# Altium schematic sheet 03-4G.SchDoc
size A3
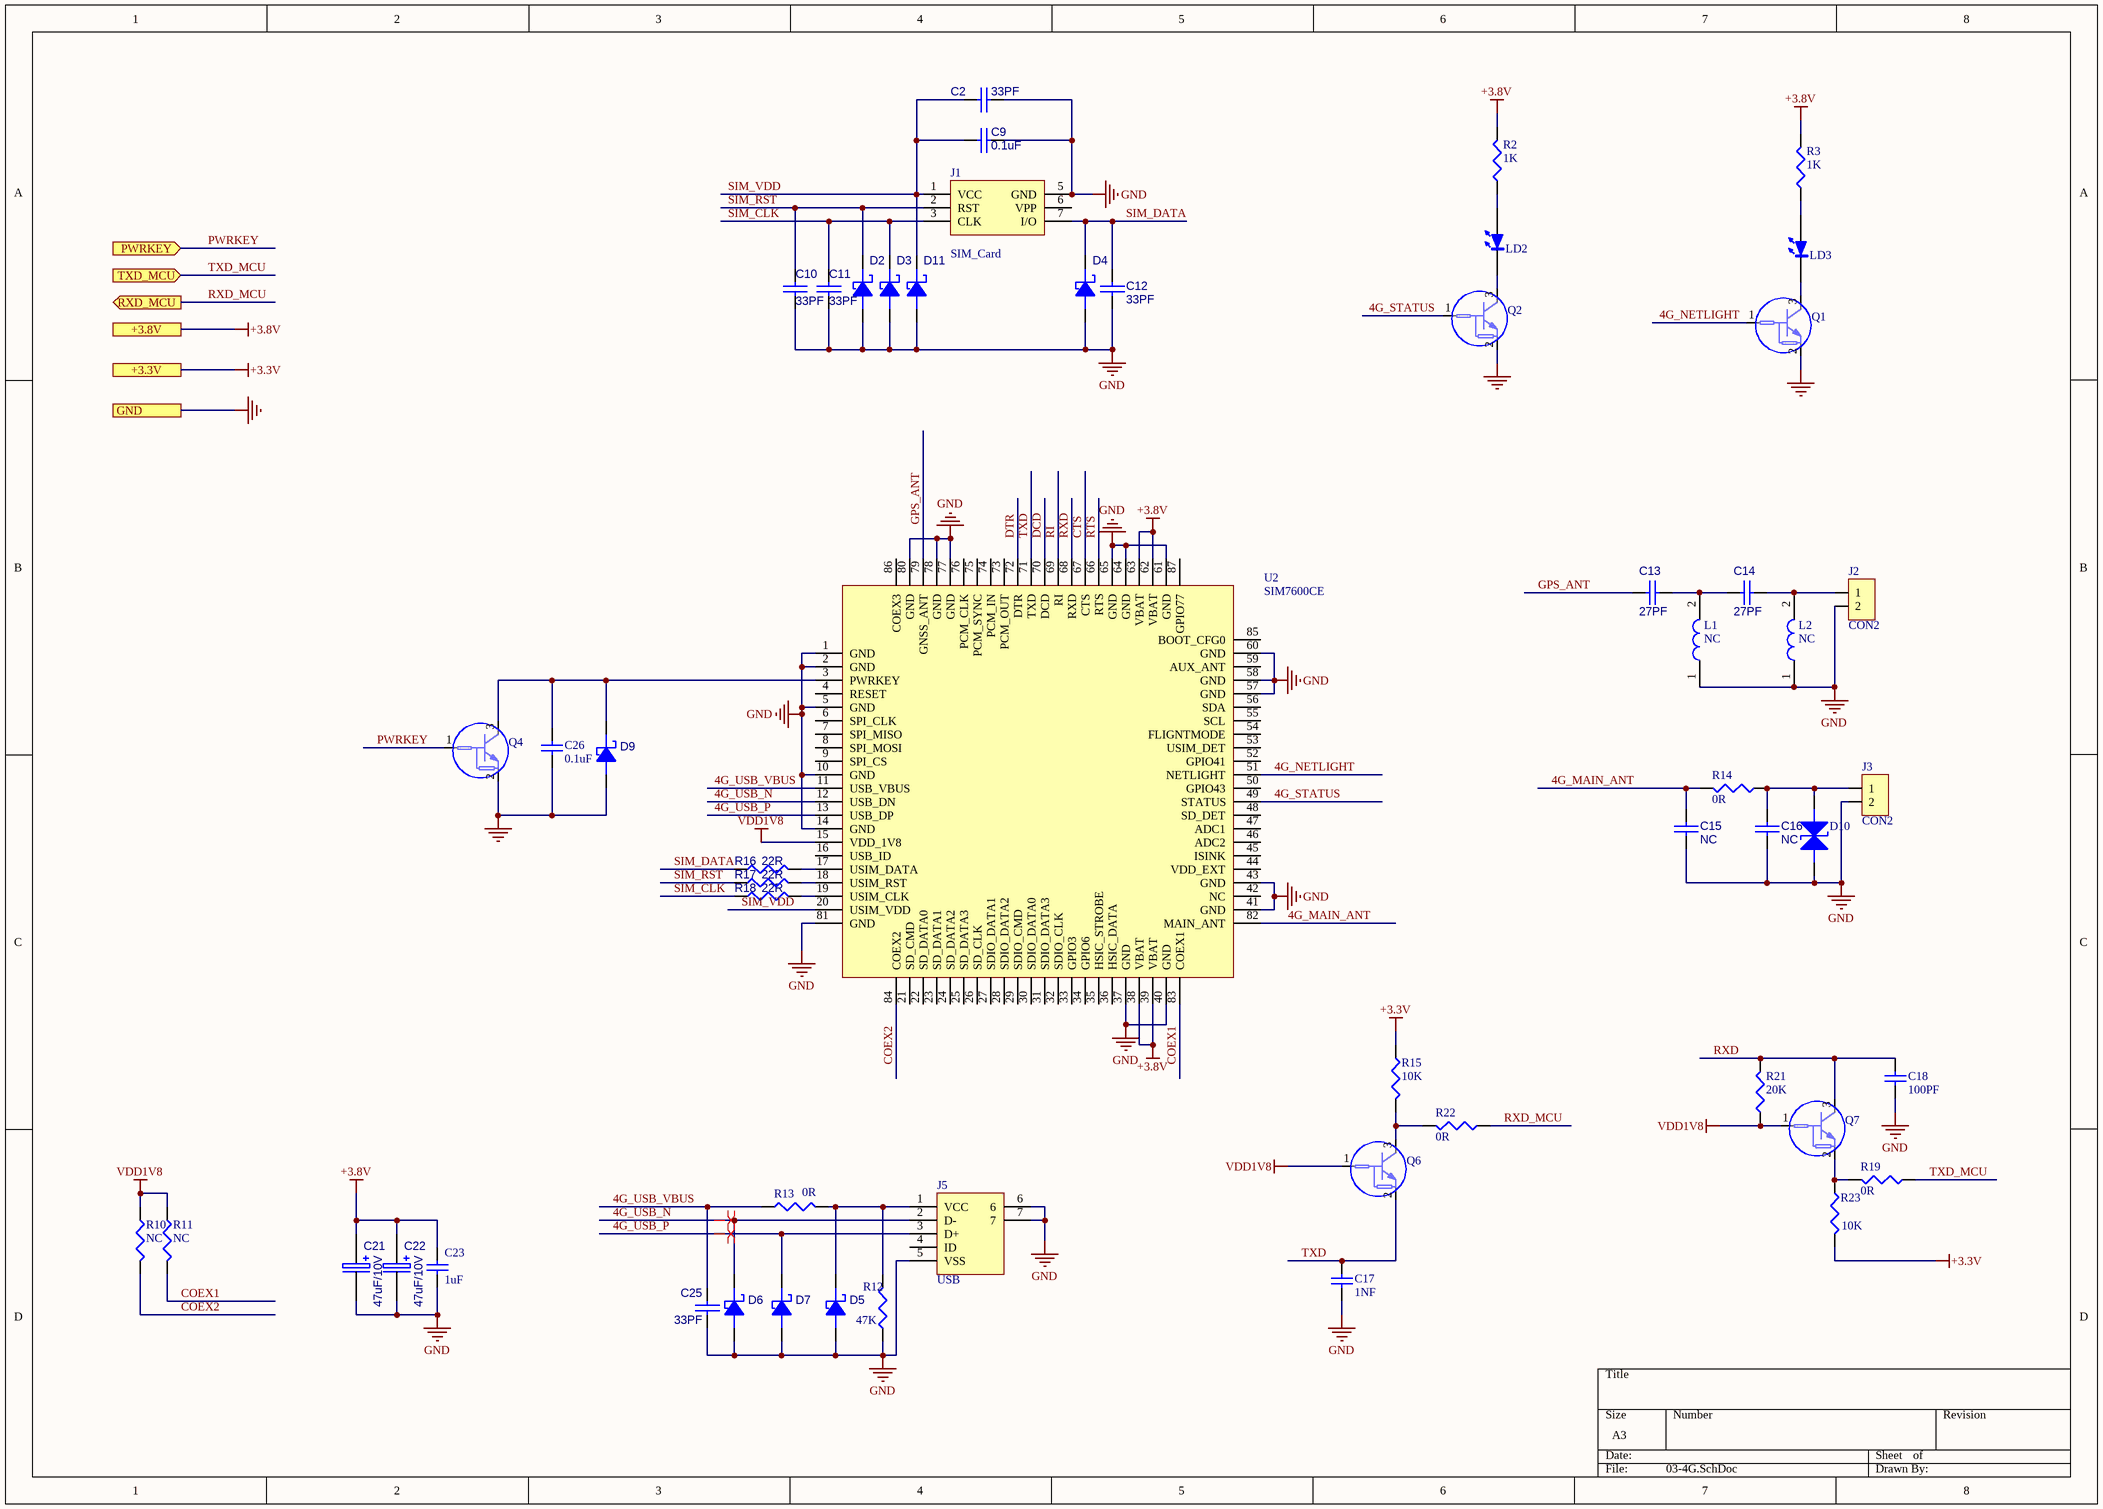
[diagram p0: 03-4G.SchDoc]

## Parts
C2  33PF  [0603_C]
C9  0.1uF  [0603_C]
C10  33PF  [0603_C]
C11  33PF  [0603_C]
C12  33PF  [0603_C]
C13  27PF  [0402]
C14  27PF  [0402]
C15  NC  [0402]
C16  NC  [0402]
C17  1NF  [0603_C]
C18  100PF  [0603_C]
C21  47uF/10V  [C_TAN_B]
C22  47uF/10V  [C_TAN_B]
C23  1uF  [0603_C]
C25  33PF  [0603_C]
C26  0.1uF  [0603_C]
D2  ESD9M5.0ST5G  [SOD-923]  (value not drawn)
D3  ESD9M5.0ST5G  [SOD-923]  (value not drawn)
D4  ESD9M5.0ST5G  [SOD-923]  (value not drawn)
D5  PESD12VS1UB  [SOD523]  (value not drawn)
D6  ESD9L5.0ST5G  [SOD-923]  (value not drawn)
D7  ESD9L5.0ST5G  [SOD-923]  (value not drawn)
D9  ESD9M5.0ST5G  [SOD-923]  (value not drawn)
D10  LXES15AAA1-153  [0402]  (value not drawn)
D11  ESD9M5.0ST5G  [SOD-923]  (value not drawn)
J1  SIM_Card  [MicroSIM-6]
J2  CON2  [RF-Z]
J3  CON2  [RF-Z]
J5  USB
L1  NC  [0402]
L2  NC  [0402]
LD2  WHITE  [LED_0603]  (value not drawn)
LD3  WHITE  [LED_0603]  (value not drawn)
Q1  DTC143ZEBTL  [SC-85]  (value not drawn)
Q2  DTC143ZEBTL  [SC-85]  (value not drawn)
Q4  DTC143ZEBTL  [SC-85]  (value not drawn)
Q6  DTC143ZEBTL  [SC-85]  (value not drawn)
Q7  DTC143ZEBTL  [SC-85]  (value not drawn)
R2  1K  [0603_R]
R3  1K  [0603_R]
R10  NC  [0603_R]
R11  NC  [0603_R]
R12  47K  [0603_R]
R13  0R  [0402]
R14  0R  [0402]
R15  10K  [0603_R]
R16  22R  [0603_R]
R17  22R  [0603_R]
R18  22R  [0603_R]
R19  0R  [0603_R]
R21  20K  [0603_R]
R22  0R  [0603_R]
R23  10K  [0603_R]
U2  SIM7600CE  [SIM7600]

## Ports
+3.3V, +3.8V, GND, PWRKEY, RXD_MCU, TXD_MCU

## Nets
+3.3V: R15.1 R23.2 ; port +3.3V
+3.8V: C21.1(+) C22.1(+) C23.2 R2.1 R3.1 U2.38(VBAT) U2.39(VBAT) U2.62(VBAT) U2.63(VBAT) ; port +3.8V
GND: C2.2 C9.2 C10.1 C11.1 C12.1 C15.1 C16.1 C17.2 C18.1 C21.2(-) C22.2(-) C23.1 C25.2 C26.1 D2.1(ANODE) D3.1(ANODE) D4.1(ANODE) D5.1(ANODE) D6.1(ANODE) D7.1(ANODE) D9.1(ANODE) D10.2 D11.1(ANODE) J1.5(GND) J2.2 J3.2 J5.5(VSS) J5.6 J5.7 L1.1 L2.1 Q1.2(E) Q2.2(E) Q4.2(E) R12.2 U2.1(GND) U2.2(GND) U2.5(GND) U2.10(GND) U2.14(GND) U2.37(GND) U2.40(GND) U2.41(GND) U2.43(GND) U2.57(GND) U2.58(GND) U2.60(GND) U2.61(GND) U2.64(GND) U2.65(GND) U2.77(GND) U2.78(GND) U2.80(GND) U2.81(GND) ; port GND
VDD1V8: Q6.1(B) Q7.1(B) R10.1 R11.1 R21.1 U2.15(VDD_1V8)
4G_MAIN_ANT: C15.2 R14.2 U2.82(MAIN_ANT)
4G_NETLIGHT: Q1.1(B) U2.51(NETLIGHT)
4G_STATUS: Q2.1(B) U2.49(STATUS)
4G_USB_N: D6.2(CATHODE) J5.2(D-) U2.12(USB_DN)
4G_USB_P: D7.2(CATHODE) J5.3(D+) U2.13(USB_DP)
4G_USB_VBUS: C25.1 R13.1 U2.11(USB_VBUS)
COEX1: R11.2 U2.83(COEX1)
COEX2: R10.2 U2.84(COEX2)
CTS: U2.67(CTS)
DCD: U2.70(DCD)
DTR: U2.72(DTR)
GPS_ANT: C13.1 U2.79(GNSS_ANT)
PWRKEY: Q4.1(B) ; port PWRKEY
RI: U2.69(RI)
RTS: U2.66(RTS)
RXD: C18.2 Q7.3(C) R21.2 U2.68(RXD)
RXD_MCU: R22.1 ; port RXD_MCU
SIM_CLK: C11.2 D3.2(CATHODE) J1.3(CLK) R18.1
SIM_DATA: C12.2 D4.2(CATHODE) J1.7(I/O) R16.1
SIM_RST: C10.2 D2.2(CATHODE) J1.2(RST) R17.1
SIM_VDD: C2.1 C9.1 D11.2(CATHODE) J1.1(VCC) U2.20(USIM_VDD)
TXD: C17.1 Q6.2(E) U2.71(TXD)
TXD_MCU: R19.1 ; port TXD_MCU
NetC13_2: C13.2 C14.1 L1.2
NetC14_2: C14.2 J2.1 L2.2
NetC16_2: C16.2 D10.1 J3.1 R14.1
NetC26_2: C26.2 D9.2(CATHODE) Q4.3(C) U2.3(PWRKEY)
NetD5_2: D5.2(CATHODE) J5.1(VCC) R12.1 R13.2
NetLD2_A: LD2.A R2.2
NetLD2_K: LD2.K Q2.3(C)
NetLD3_A: LD3.A R3.2
NetLD3_K: LD3.K Q1.3(C)
NetQ6_3: Q6.3(C) R15.2 R22.2
NetQ7_2: Q7.2(E) R19.2 R23.1
NetR16_2: R16.2 U2.17(USIM_DATA)
NetR17_2: R17.2 U2.18(USIM_RST)
NetR18_2: R18.2 U2.19(USIM_CLK)

Not connected (* = marked no-connect by the designer): J1 6(VPP); J5 4(ID); U2 4(RESET) 6(SPI_CLK) 7(SPI_MISO) 8(SPI_MOSI) 9(SPI_CS) 16(USB_ID) 21(SD_CMD) 22(SD_DATA0) 23(SD_DATA1) 24(SD_DATA2) 25(SD_DATA3) 26(SD_CLK) 27(SDIO_DATA1) 28(SDIO_DATA2) 29(SDIO_CMD) 30(SDIO_DATA0) 31(SDIO_DATA3) 32(SDIO_CLK) 33(GPIO3) 34(GPIO6) 35(HSIC_STROBE) 36(HSIC_DATA) 42(NC) 44(VDD_EXT) 45(ISINK) 46(ADC2) 47(ADC1) 48(SD_DET) 50(GPIO43) 52(GPIO41) 53(USIM_DET) 54(FLIGNTMODE) 55(SCL) 56(SDA) 59(AUX_ANT) 73(PCM_OUT) 74(PCM_IN) 75(PCM_SYNC) 76(PCM_CLK) 85(BOOT_CFG0) 86(COEX3) 87(GPIO77)

## Layout directives
differential pair: 4G_USB_N, 4G_USB_P

## Library data of the parts
C2 C9-C16 C25 = CAP
C17 C18 C23 C26 = Cap Semi: Capacitor; Published: 8-Jun-2000; LatestRevisionDate: 29-May-2009; LatestRevisionNote: IPC-7351 Footprint Added.; PackageReference: C1206; Publisher: Altium Limited; PackageDescription: Chip Capacitor
C21 C22 = ECAP: E-CAP
D2-D7 D9 D11 = DIODE SCHOTTKY
D10 = DIODE TVS BI-DIR
J5 = USB-M
L1 L2 = L
LD2 LD3 = LED
Q1 Q2 Q4 Q6 Q7 = DTC143ZETL
R2 R3 R10-R15 R19 R21-R23 = RES1
R16-R18 = R0.25W: RESISTOR
U2 = SIM7600